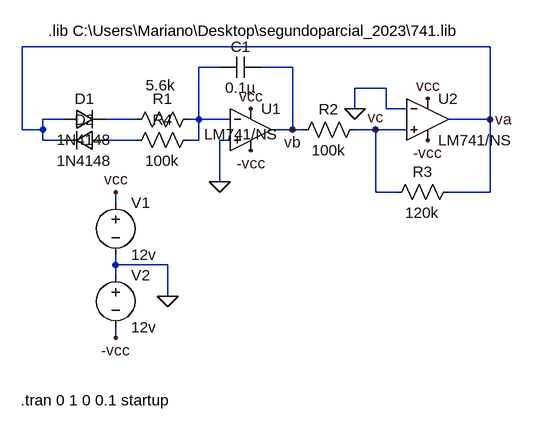
[diagram p0: schematic eje2_2023.asc]
eje2_2023.asc, the LTspice schematic file:
Version 4
SHEET 1 880 680
WIRE 528 48 -192 48
WIRE 112 80 80 80
WIRE 224 80 176 80
WIRE 368 112 320 112
WIRE 320 144 320 112
WIRE 368 144 368 112
WIRE 400 144 368 144
WIRE -128 160 -160 160
WIRE -16 160 -64 160
WIRE 80 160 80 80
WIRE 80 160 64 160
WIRE 128 160 80 160
WIRE 528 160 528 48
WIRE 528 160 464 160
WIRE -192 176 -192 48
WIRE -160 176 -160 160
WIRE -160 176 -192 176
WIRE 224 176 224 80
WIRE 224 176 192 176
WIRE 240 176 224 176
WIRE 352 176 320 176
WIRE 400 176 352 176
WIRE -160 192 -160 176
WIRE -128 192 -160 192
WIRE -16 192 -64 192
WIRE 80 192 80 160
WIRE 80 192 64 192
WIRE 128 192 112 192
WIRE 112 256 112 192
WIRE 352 272 352 176
WIRE 384 272 352 272
WIRE 528 272 528 160
WIRE 528 272 464 272
WIRE -48 288 -48 272
WIRE -48 384 -48 368
WIRE 32 384 -48 384
WIRE -48 400 -48 384
WIRE 32 432 32 384
WIRE -48 496 -48 480
FLAG 32 432 0
FLAG -48 272 vcc
FLAG -48 496 -vcc
FLAG 112 256 0
FLAG 160 144 vcc
FLAG 160 208 -vcc
FLAG 320 144 0
FLAG 432 128 vcc
FLAG 432 192 -vcc
FLAG 528 160 va
FLAG 224 176 vb
FLAG 352 176 vc
SYMBOL diode -128 176 R270
WINDOW 0 32 32 VTop 2
WINDOW 3 0 32 VBottom 2
SYMATTR InstName D1
SYMATTR Value 1N4148
SYMBOL diode -64 176 R90
WINDOW 0 0 32 VBottom 2
WINDOW 3 32 32 VTop 2
SYMATTR InstName D2
SYMATTR Value 1N4148
SYMBOL voltage -48 272 R0
WINDOW 123 0 0 Left 0
WINDOW 39 0 0 Left 0
SYMATTR InstName V1
SYMATTR Value 12v
SYMBOL voltage -48 384 R0
WINDOW 123 0 0 Left 0
WINDOW 39 0 0 Left 0
SYMATTR InstName V2
SYMATTR Value 12v
SYMBOL res 336 160 R90
WINDOW 0 0 56 VBottom 2
WINDOW 3 32 56 VTop 2
SYMATTR InstName R2
SYMATTR Value 100k
SYMBOL res 480 256 R90
WINDOW 0 0 56 VBottom 2
WINDOW 3 32 56 VTop 2
SYMATTR InstName R3
SYMATTR Value 120k
SYMBOL cap 176 64 R90
WINDOW 0 0 32 VBottom 2
WINDOW 3 32 32 VTop 2
SYMATTR InstName C1
SYMATTR Value 0.1µ
SYMBOL OpAmps\\opamp2 160 112 R0
WINDOW 3 -72 71 Left 2
SYMATTR InstName U1
SYMATTR Value LM741/NS
SYMBOL OpAmps\\opamp2 432 96 R0
SYMATTR InstName U2
SYMATTR Value LM741/NS
SYMBOL res 80 144 R90
WINDOW 0 0 56 VBottom 2
WINDOW 3 -52 59 VTop 2
SYMATTR InstName R1
SYMATTR Value 5.6k
SYMBOL res 80 176 R90
WINDOW 0 0 56 VBottom 2
WINDOW 3 32 56 VTop 2
SYMATTR InstName R4
SYMATTR Value 100k
TEXT -152 24 Left 2 !.lib C:\\Users\\Mariano\\Desktop\\segundoparcial_2023\\741.lib
TEXT -194 592 Left 2 !.tran 0 1 0 0.1 startup

The netlist it stands for:
* eje2_2023.asc
D1 va N002 1N4148
D2 N003 va 1N4148
V1 vcc 0 12v
V2 0 -vcc 12v
R2 vc vb 100k
R3 va vc 120k
C1 vb N001 0.1µ
XU1 0 N001 vcc -vcc vb LM741/NS  ; pins In+ In- V+ V- OUT
XU2 vc 0 vcc -vcc va LM741/NS  ; pins In+ In- V+ V- OUT
R1 N001 N002 5.6k
R4 N001 N003 100k
.model D D
.lib standard.dio
.lib C:\Users\Mariano\Desktop\segundoparcial_2023\741.lib
.tran 0 1 0 0.1 startup
.backanno
.end